# EAGLE design usb328 (EAGLE 7.2.0)
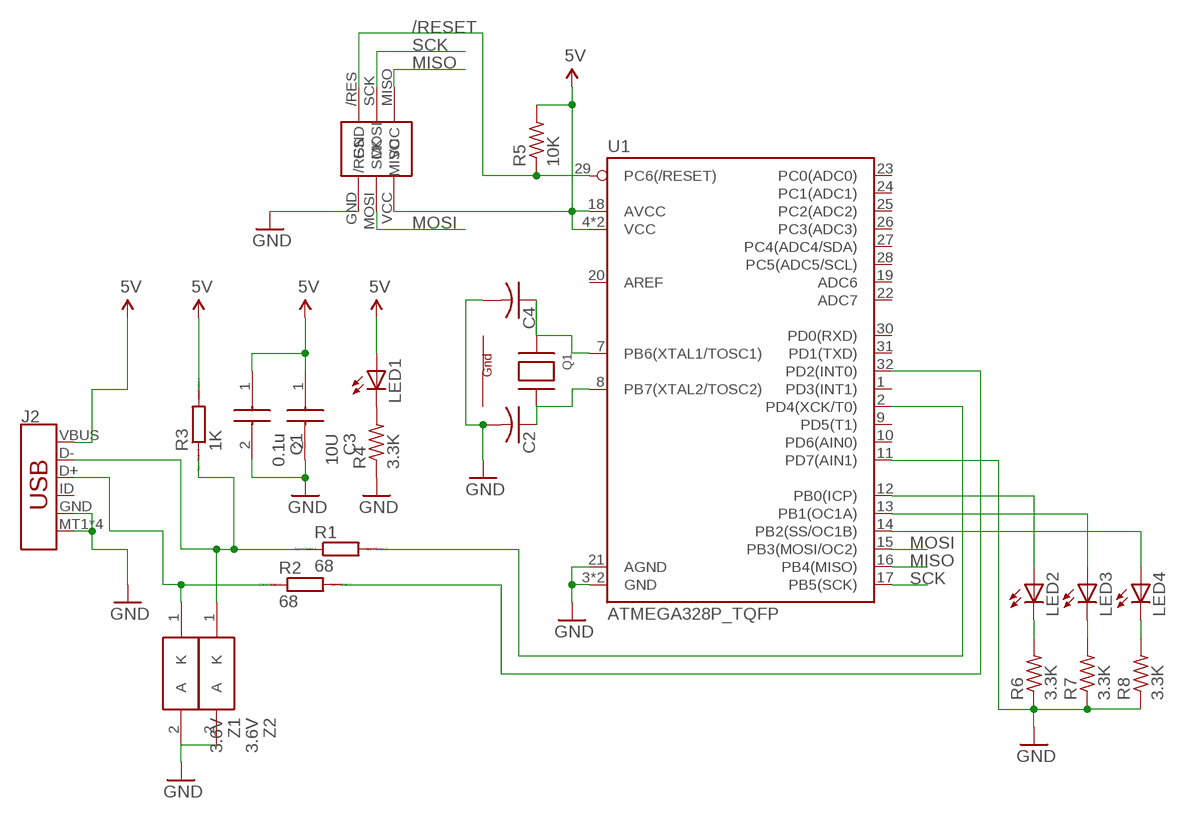
[diagram p0: schematic, sheet 1]

## Parts
C1  0.1u  GRM2165C1H220JZ01D  [CAPC2012X70N]
C2  C-USC0805  [C0805]
C3  10U  GRM2165C1H220JZ01D  [CAPC2012X70N]
C4  C-USC0805  [C0805]
J2  USB_MICRO-B_SMT  [USB-MICROB]
LED1  LEDCHIPLED_0805  [CHIPLED_0805]
LED2  LEDCHIPLED_0805  [CHIPLED_0805]
LED3  LEDCHIPLED_0805  [CHIPLED_0805]
LED4  LEDCHIPLED_0805  [CHIPLED_0805]
Q1  XTAL-4-3225  [NX3225]
R1  68  RR2012  [R2012]
R2  68  RR2012  [R2012]
R3  1K  RR2012  [R2012]
R4  3.3K  R-US_R0805  [R0805]
R5  10K  R-US_R0805  [R0805]
R6  3.3K  R-US_R0805  [R0805]
R7  3.3K  R-US_R0805  [R0805]
R8  3.3K  R-US_R0805  [R0805]
U1  ATMEGA328P_TQFP  [TQFP32-08]
U$4  ICSP-E  [ICSP-E]
Z1  3.6V  TFZVTR15B  [TUM-D2]
Z2  3.6V  TFZVTR15B  [TUM-D2]

## Nets
5V: C1.1 C3.1 J2.VBUS LED1.A R3.2 R5.2 U1.4(VCC) U1.6(VCC) U1.18(AVCC) U$4.VCC
/RESET: R5.1 U1.29(PC6(/RESET)) U$4./RES
GND: C1.2 C2.2 C3.2 C4.2 J2.GND J2.MT1(SHIELD) J2.MT2(SHIELD) J2.P$1(SHIELD) J2.P$2(SHIELD) R4.1 R6.1 R7.1 R8.1 U1.3(GND) U1.5(GND) U1.11(PD7(AIN1)) U1.21(AGND) U$4.GND Z1.2(A) Z2.2(A)
MISO: U1.16(PB4(MISO)) U$4.MISO
MOSI: U1.15(PB3(MOSI/OC2)) U$4.MOSI
N$1: R1.2 U1.2(PD4(XCK/T0))
N$2: R2.2 U1.32(PD2(INT0))
N$3: C4.1 Q1.1(X1) U1.7(PB6(XTAL1/TOSC1))
N$4: C2.1 Q1.3(X2) U1.8(PB7(XTAL2/TOSC2))
N$5: LED1.C R4.2
N$6: LED2.A U1.12(PB0(ICP))
N$7: LED3.A U1.13(PB1(OC1A))
N$8: LED2.C R6.2
N$9: LED3.C R7.2
N$10: J2.D- R1.1 R3.1 Z2.1(K)
N$11: J2.D+ R2.1 Z1.1(K)
N$12: LED4.A U1.14(PB2(SS/OC1B))
N$13: LED4.C R8.2
SCK: U1.17(PB5(SCK)) U$4.SCK
Unconnected: J2.ID U1.1(PD3(INT1)) U1.9(PD5(T1)) U1.10(PD6(AIN0)) U1.19(ADC6) U1.20(AREF) U1.22(ADC7) U1.23(PC0(ADC0)) U1.24(PC1(ADC1)) U1.25(PC2(ADC2)) U1.26(PC3(ADC3)) U1.27(PC4(ADC4/SDA)) U1.28(PC5(ADC5/SCL)) U1.30(PD0(RXD)) U1.31(PD1(TXD))

## Power pins joined to a net without a drawn wire
G1: Q1.4(G1)
G2: Q1.2(G2)

## Library data of the parts
C1 C3 = GRM2165C1H220JZ01D:GRM2165C1H220JZ01D: MURATA - GRM2165C1H220JZ01D - CAP, MLCC, C0G/NP0, 22PF, 50V, 0805 Source: Datasheet <http://www.murata.com/~/media/webrenewal/support/library/catalog/products/capacitor/mlcc/c02e.pdf>; ARROW_PART_NUMBER: GRM2165C1H220JZ01D; ARROW_PRICE-STOCK: https://www.arrow.com/en/products/grm2165c1h220jz01d/murata-manufacturing; DESCRIPTION: MURATA - GRM2165C1H220JZ01D - CAP, MLCC, C0G/NP0, 22PF, 50V, 0805; HEIGHT: 0.7mm; MANUFACTURER_NAME: Murata Electronics; MANUFACTURER_PART_NUMBER: GRM2165C1H220JZ01D; RS_PART_NUMBER: 7236243; RS_PRICE-STOCK: http://uk.rs-online.com/web/p/products/7236243
C2 C4 = adafruit:C-US: CAPACITOR, American symbol
J2 = SparkFun-Connectors:USB_MICRO-B: USB Type Micro-B Connector Male/female and PTH/SMT variants SparkFun Products: SparkFun microB USB Breakout <https://www.sparkfun.com/products/12035> SparkFun USB microB Plug Breakout <https://www.sparkfun.com/products/10031> SparkFun ESP8266 Thing <https://www.sparkfun.com/products/13231>; PROD_ID: CONN-09505; SF_ID: PRT-08533
LED1-LED4 = adafruit:LED: LED OSRAM: - CHIPLED LG R971, LG N971, LY N971, LG Q971, LY Q971, LO R971, LY R971 LH N974, LH R974 LS Q976, LO Q976, LY Q976 LO Q996 - Hyper CHIPLED LW Q18S LB Q993, LB Q99A, LB R99A - SideLED LS A670, LO A670, LY A670, LG A670, LP A670 LB A673, LV A673, LT A673, LW A673 LH A674 LY A675 LS A676, LA A676, LO A676, LY A676, LW A676 LS A679, LY A679, LG A679 - Hyper Micro SIDELED® LS Y876, LA Y876, LO Y876, LY Y876 LT Y87S - SmartLED LW L88C, LW L88S LB L89C, LB L89S, LG L890 LS L89K, LO L89K, LY L89K LS L896, LA L896, LO L896, LY L896 - TOPLED LS T670, LO T670, LY T670, LG T670, LP T670 LSG T670, LSP T670, LSY T670, LOP T670, LYG T670 LG T671, LOG T671, LSG T671 LB T673, LV T673, LT T673, LW T673 LH T674 LS T676, LA T676, LO T676, LY T676, LB T676, LH T676, LSB T676, LW T676 LB T67C, LV T67C, LT T67C, LS T67K, LO T67K, LY T67K, LW E67C LS E67B, LA E67B, LO E67B, LY E67B, LB E67C, LV E67C, LT E67C LW T67C LS T679, LY T679, LG T679 LS T770, LO T770, LY T770, LG T770, LP T770 LB T773, LV T773, LT T773, LW T773 LH T774 LS E675, LA E675, LY E675, LS T675 LS T776, LA T776, LO T776, LY T776, LB T776 LHGB T686 LT T68C, LB T68C - Hyper Mini TOPLED® LB M676 - Mini TOPLED Santana® LG M470 LS M47K, LO M47K, LY M47K Source: http://www.osram.convergy.de/
Q1 = adafruit:XTAL-4: Classic 4-pin 3.2 x 2.5mm crystal
R1-R3 = eagle-ltspice:R: RESISTOR, European symbol; SPICEMODEL: NONE; SPICEPREFIX: R
R4-R8 = adafruit:R-US_: RESISTOR, American symbol
U1 = SparkFun-IC-Microcontroller:ATMEGA328P_TQFP: Popular 328P in QFP Storefront component: ATmega328 - TQFP <https://www.sparkfun.com/products/13448> (COM-13448) Datasheet <http://www.sparkfun.com/datasheets/Components/SMD/ATMega328.pdf> SparkFun Products SparkFun RedBoard - Programmed with Arduino <https://www.sparkfun.com/products/12757> (DEV-12757) Arduino Pro Mini 328 - 5V/16MHz <https://www.sparkfun.com/products/11113> (DEV-11113) Arduino Pro Mini 328 - 3.3V/8MHz <https://www.sparkfun.com/products/11114> (DEV-11114) SparkFun OpenLog <https://www.sparkfun.com/products/13712> (DEV-13712) SparkFun MicroView - OLED Arduino Module <https://www.sparkfun.com/products/12923> (DEV-12923) SparkFun Digital Sandbox <https://www.sparkfun.com/products/12651> (DEV-12651) SparkFun PicoBoard <https://www.sparkfun.com/products/11888> (WIG-11888) Arduino Fio <https://www.sparkfun.com/products/10116> (DEV-10116) LilyPad Arduino 328 Main Board <https://www.sparkfun.com/products/13342> (DEV-13342) SparkFun RedStick <https://www.sparkfun.com/products/13741> (DEV-13741) LilyPad MP3 <https://www.sparkfun.com/products/11013> (DEV-11013) LilyPad Arduino SimpleSnap <https://www.sparkfun.com/products/10941> (DEV-10941) SparkFun Stepoko <https://www.sparkfun.com/products/13899> (ROB-13899) SparkFun Geiger Counter <https://www.sparkfun.com/products/11345> (SEN-11345) SparkFun EL Sequencer <https://www.sparkfun.com/products/12781> (COM-12781) Arduino Pro 328 - 5V/16MHz <https://www.sparkfun.com/products/10915> (DEV-10915) CryptoCape <https://www.sparkfun.com/products/12773> (DEV-12773) SparkFun IR Thermometer Evaluation Board - MLX90614 <https://www.sparkfun.com/products/10740> (SEN-10740) SparkFun RedBot Mainboard <https://www.sparkfun.com/products/12097> (ROB-12097) Arduino Pro 328 - 3.3V/8MHz <https://www.sparkfun.com/products/10914> (DEV-10914) SparkFun Block for Intel® Edison - Arduino <https://www.sparkfun.com/products/13036> (DEV-13036) SparkFun Simon Says - Surface Mount Soldering Kit <https://www.sparkfun.com/products/10935> (KIT-10935) SparkFun 7-Segment Serial Display - Red <https://www.sparkfun.com/products/11441> (COM-11441) SparkFun 7-Segment Serial Display - White <https://www.sparkfun.com/products/11629> (COM-11629) SparkFun 7-Segment Serial Display - Yellow <https://www.sparkfun.com/products/11443> (COM-11443) SparkFun 7-Segment Serial Display - Kelly Green <https://www.sparkfun.com/products/11440> (COM-11440) SparkFun 7-Segment Serial Display - Blue <https://www.sparkfun.com/products/11442> (COM-11442) SparkFun OpenSegment Serial Display - 20mm (Blue) <https://www.sparkfun.com/products/11647> (COM-11647) SparkFun OpenSegment Serial Display - 20mm (Green) <https://www.sparkfun.com/products/11646> (COM-11646) SparkFun OpenSegment Serial Display - 20mm (White) <https://www.sparkfun.com/products/11648> (COM-11648) SparkFun OpenSegment Serial Display - 20mm (Red) <https://www.sparkfun.com/products/11644> (COM-11644) SparkFun OpenSegment Serial Display - 20mm (Yellow) <https://www.sparkfun.com/products/11645> (COM-11645) SparkFun OpenSegment Shield <https://www.sparkfun.com/products/13190> (DEV-13190); PROD_ID: IC-09069
U$4 = ICSP-E:ICSP-E
Z1 Z2 = TFZVTR15B:TFZVTR15B: ROHM - TFZVTR15B - ZENER DIODE, 0.5W, SOD-323HE Source: Datasheet <http://www.farnell.com/datasheets/2300201.pdf>; ARROW_PART_NUMBER: TFZVTR15B; ARROW_PRICE-STOCK: http://uk.rs-online.com/web/p/products/1715293; DESCRIPTION: ROHM - TFZVTR15B - ZENER DIODE, 0.5W, SOD-323HE; HEIGHT: mm; MANUFACTURER_NAME: ROHM Semiconductor; MANUFACTURER_PART_NUMBER: TFZVTR15B; RS_PART_NUMBER: 1715293; RS_PRICE-STOCK: http://uk.rs-online.com/web/p/products/1715293

## Net classes
0 default: width 0.4 mm

## Board
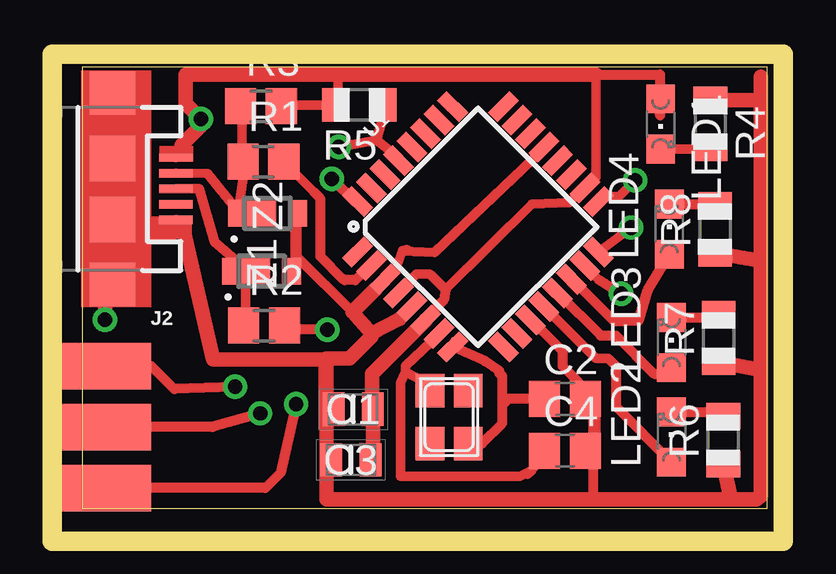
[diagram p1: board, top side]
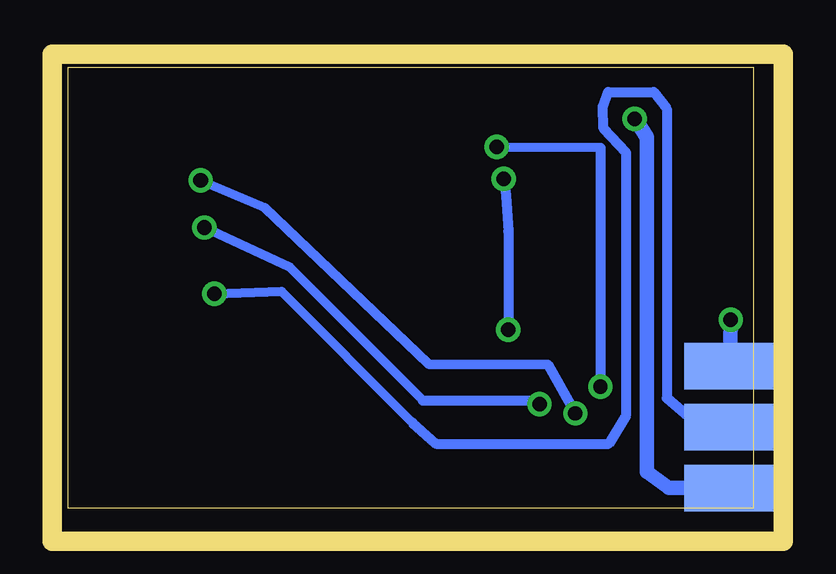
[diagram p2: board, bottom side, seen from below]

Size 28.57 x 18.41 mm. Coordinates in mm from the lower left corner, seen from the top.
Outline: 0,0 28.57,0 28.57,18.41 0,18.41 0,0
Copper layers (1*16): Top 0.035mm / dielectric 1.5mm / Bottom 0.035mm
Design rules "default *": minimum track width 10mil, minimum drill 24mil, track to track 6mil, track to pad 6mil, pad to pad 6mil, via to via 6mil, smd to smd 6mil, copper to edge 40mil, drill to drill 8mil, minimum pad ring 10mil, minimum via ring 8mil, stop-mask expansion 4mil, vias tented up to drill 0mil, thermal gap 10mil
Milling: 4 lines

### Footprints (pad centres in the part's own frame; a part is rotated, then mirrored left to right if it is on the bottom)
CAPC2012X70N = smd 0.91 x 1.39: 1 -0.82,0; 2 0.82,0
C0805 = smd 1.3 x 1.5: 1 -0.85,0; 2 0.85,0
USB-MICROB = smd 1.4 x 0.35: D+ -2.65,0; D- -2.65,-0.65; GND -2.65,1.3; ID -2.65,0.65; VBUS -2.65,-1.3 | smd 1.9 x 1.8: MT1 0,-4; MT2 0,4 | smd 1.9 x 1.9: P$1 0,-1.27; P$2 0,1.27
CHIPLED_0805 = smd 1.2 x 1.2: A 0,-1.05; C 0,1.05
NX3225 = smd 1.4 x 1.2: 1 -1.1,-0.8; 2 1.1,-0.8; 3 1.1,0.8; 4 -1.1,0.8
R2012 = smd 1.3 x 1.5: 1 -0.85,0; 2 0.85,0
R0805 = smd 1.1 x 1.4: 1 -1,0; 2 1,0
TQFP32-08 = smd 1.27 x 0.559: 1 -4.293,2.8; 2 -4.293,2; 3 -4.293,1.2; 4 -4.293,0.4; 5 -4.293,-0.4; 6 -4.293,-1.2; 7 -4.293,-2; 8 -4.293,-2.8; 17 4.293,-2.8; 18 4.293,-2; 19 4.293,-1.2; 20 4.293,-0.4; 21 4.293,0.4; 22 4.293,1.2; 23 4.293,2; 24 4.293,2.8 | smd 0.559 x 1.27: 9 -2.8,-4.293; 10 -2,-4.293; 11 -1.2,-4.293; 12 -0.4,-4.293; 13 0.4,-4.293; 14 1.2,-4.293; 15 2,-4.293; 16 2.8,-4.293; 25 2.8,4.293; 26 2,4.293; 27 1.2,4.293; 28 0.4,4.293; 29 -0.4,4.293; 30 -1.2,4.293; 31 -2,4.293; 32 -2.8,4.293
ICSP-E = smd 3.81 x 1.93: /RES 0,-2.54; MISO 0,2.54; SCK 0,0 | smd 3.81 x 1.93 bottom: GND 0,-2.54; MOSI 0,0; VCC 0,2.54
TUM-D2 = smd 1.1 x 2: 1 0,0 | smd 1.1 x 0.8: 2 0,1.9

### Placement (x,y rotation side)
C1  11.3,4.14 180 top
C2  20.13,4.57 0 top
C3  11.21,2.03 180 top
C4  20.13,2.41 0 top
J2  1.27,13.33 180 top
LED1  24.12,16.03 180 top
LED2  24.57,2.98 0 top
LED3  24.57,6.92 0 top
LED4  24.48,11.65 0 top
Q1  15.3,3.81 270 top
R1  7.56,14.47 0 top
R2  7.59,7.63 0 top
R3  7.46,16.77 0 top
R4  26.19,16.03 270 top
R5  11.56,16.83 180 top
R6  26.73,2.86 90 top
R7  26.54,7.11 90 top
R8  26.38,11.65 90 top
U1  16.51,11.75 45 top
U$4  0.98,3.4 180 top
Z1  6.84,9.9 270 top
Z2  7.08,12.31 270 top

### Tracks (layer width: path | path; a pad name or v marks a point on that pad's centre or on a via)
5V  (via drill 0.61)
  Top 0.4: R3.2 8.41,16.83 R5.2 10.64,16.99 10.7,18.1 | 14.48,9.78 13.94,9.78 13.49,9.3 U1.4 | 14.73,8.32 U1.6 | 21.43,18.1 21.43,13.81 21.11,13.49 U1.18 20.64,13.08 20.32,12.76 18.76,12.7 15.14,9.14
  Top 0.406: 14.48,9.78 14.57,9.72 15.14,9.14 15.08,8.7 14.73,8.32 | J2.VBUS 3.92,14.91 4.16,15.14 | 21.43,18.1 24.1,18.1 24.1,16.4 LED1.A
  Top 0.61: 21.43,18.1 10.7,18.1 4.32,18.1 4.32,16.89 v4.95,16.26 4.95,15.94 4.16,15.14 | U1.6 14.32,7.85 12.1,5.62 12.1,4.17 C1.1 12.12,2.13 C3.1
  Bottom 0.61: U$4.VCC 3.52,0.86 4.44,1.52 4.44,15.49 v4.95,16.26
/RESET  (via drill 0.6, 0.61)
  Top 0.4: 12.29,15.37 12.8,14.95 U1.29 | 12.29,15.37 12.7,16.83 R5.1 | v10.7,15.08 12.29,15.37
  Top 0.406: v6.38,5.08 3.84,4.98 2.89,5.94 U$4./RES
  Bottom 0.4: 6.38,15.05 v10.7,15.08
  Bottom 0.406: 6.38,15.05 v6.38,5.08
GND  (via drill 0.6)
  Top 0.4: 21.43,1.9 21.43,2.38 C4.2 21.43,2.54 21.43,4.44 C2.2 | Z1.2 8.89,10 8.89,12.22 Z2.2 8.95,11.75 | 12.26,9.18 U1.3 13.05,9.91 13.37,10.76 13.56,10.79 13.37,10.73 14.7,10.67 18.8,14.57 19.34,15.11 U1.21 | 13.24,7.91 U1.5
  Top 0.406: J2.P$2 2.48,10.79 2.67,11.87 | 3.76,11.87 J2.GND 4.24,11.57 | 1.57,11.26 J2.MT2 J2.P$1 J2.MT1 | 8.95,11.75 8.95,10.51 11.27,8.19 | 21.3,0.38 21.3,4.35 21.08,4.57 C2.2 20.67,4.88 20.67,5.3 20.03,5.94 20.03,6.57 18.74,7.86 U1.11
  Top 0.61: 27.02,0.38 21.3,0.38 10.19,0.38 10.19,1.84 | 27.02,0.38 28.13,0.38 28.29,0.54 28.29,5.94 | 12.26,9.18 11.27,8.19 12.06,7.3 | 12.06,7.3 13.24,7.91 | 2.67,11.87 3.76,11.87 | 1.57,11.26 4.24,11.57 5.46,6.22 10.16,6.22 | v0.95,7.87 0.98,9.05 J2.MT2 | 10.16,6.22 10.19,6.25 | 10.19,6.25 10.19,1.84 | 10.19,1.84 C3.2 | 10.16,6.22 10.16,4.46 C1.2 | 12.06,7.3 12.06,7.18 11.14,6.25 10.19,6.25 | 28.29,5.94 28.29,10.38 | 28.29,10.38 28.29,16.41 | 28.29,16.41 28.29,18 | R4.1 28.3,17.03 28.29,16.41 | R8.1 28.24,10.33 28.29,10.38 | R7.1 28.15,5.79 28.29,5.94 | R6.1 27.05,0.41 27.02,0.38
  Bottom 0.61: U$4.GND v0.95,7.87
MISO  (via drill 0.6, 0.61)
  Top 0.4: v22.89,11.72 U1.16
  Top 0.406: v8.92,4.35 8.29,1.49 7.65,0.86 U$4.MISO
  Bottom 0.4: v22.89,11.72 19.34,10.06 13.78,4.51
  Bottom 0.406: 13.78,4.51 9.08,4.51 v8.92,4.35
MOSI  (via drill 0.61)
  Top 0.4: v22.48,8.95 21.53,9.56 21.02,10.03 U1.15
  Bottom 0.4: v22.48,8.95 19.68,9.05 14.21,3.57
  Bottom 0.406: 14.21,3.57 13.24,2.7 6.03,2.7 5.3,3.9 5.3,14.83 6.25,15.84 6.29,16.76 6.06,17.37 4.16,17.37 3.62,16.67 3.62,4.6 2.57,3.71 1.3,3.71 U$4.MOSI
N$1
  Top 0.4: 9.68,13.18 8.41,14.45 R1.2
  Top 0.406: U1.2 12,10.13 11.4,9.52 10.95,9.52 10.92,9.56 10.89,9.56 9.94,10.51 9.94,12.92 9.68,13.18
N$2  (via drill 0.61)
  Top 0.4: 9.05,7.46 8.57,7.46 R2.2
  Top 0.406: U1.32 11.49,12.73 v10.41,13.75 | v10.22,7.46 9.05,7.46
  Bottom 0.406: v10.41,13.75 10.32,13.05 10.22,11.56 v10.22,7.46
N$3
  Top 0.4: 13.48,5.7 14.8,5.02 Q1.1 | 13.48,5.7 13.49,5.94 14.54,6.95 14.76,7.14 U1.7 | C4.1 19.53,2.38 18.57,1.43 18.76,1.59 18.26,1.33 13.27,1.33 13.27,5.24 13.48,5.7
N$4
  Top 0.4: 15.56,6.98 U1.8
  Top 0.406: U1.8 16.8,6.15 17.4,5.74 17.4,5.65 17.53,5.52 17.53,4.32 | Q1.3 16.68,2.71 17.53,3.56 17.53,4.32 | C2.1 17.78,4.57 17.53,4.32
N$5
  Top 0.406: LED1.C 26.21,15.02 R4.2
N$6
  Top 0.406: U1.12 19.36,8.33 21.4,6.29 21.94,6.25 22.26,5.94 22.26,4.25 LED2.A
N$7
  Top 0.406: U1.13 21.62,7.21 22.26,7.21 23.84,5.62 24.32,5.62 LED3.A
N$8
  Top 0.406: LED2.C 26.56,4.03 R6.2
N$9
  Top 0.406: LED3.C 26.4,7.97 R7.2
N$10
  Top 0.4: 6.51,12.38 6.98,12.7 6.98,12.38 Z2.1 | 6.51,12.38 5.24,13.97 J2.D- | 6.51,12.38 6.83,14.45 R1.1 6.67,14.6 6.67,16.67 R3.1
N$11
  Top 0.4: J2.D+ 4.89,13.33 5.52,11.11 6.83,10 Z1.1 6.83,9.84 6.83,7.46 R2.1
N$12
  Top 0.406: U1.14 20.47,9.53 22.19,7.81 23.21,7.84 23.59,9.11 LED4.A
N$13
  Top 0.406: LED4.C 26.33,12.7 R8.2
SCK  (via drill 0.6, 0.61)
  Top 0.4: v23.05,13.68 22.38,13.02 21.59,13.02 U1.17
  Top 0.406: v7.43,3.97 5.43,3.4 U$4.SCK
  Bottom 0.4: v23.05,13.68 20.38,12.54 13.56,6.03
  Bottom 0.406: 13.56,6.03 8.57,6 v7.43,3.97
(copper drawn outside any net)
  shapes: Top area x3